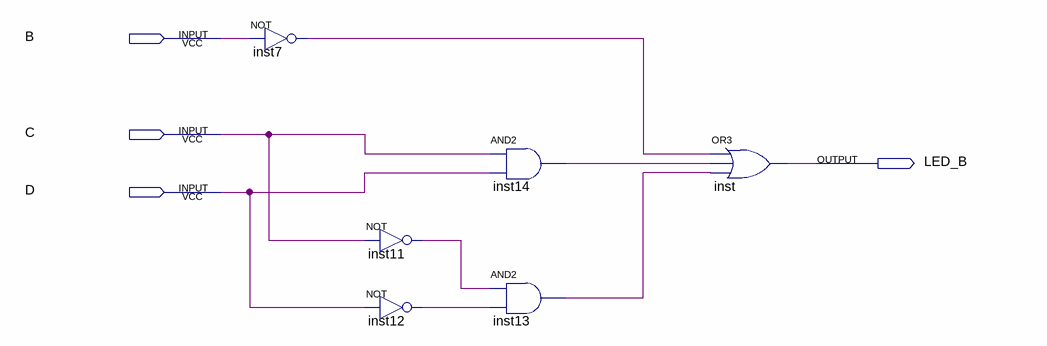
[diagram p0: schematic sheet]
// Quartus schematic led_b.bdf as structural Verilog: 6 symbols, 4 pins
module led_b (
  input  B,
  input  C,
  input  D,
  output LED_B
);

  wire inst7_out, inst11_out, inst12_out, inst13_out, inst14_out;

  not inst7 (inst7_out, B);
  not inst11 (inst11_out, C);
  not inst12 (inst12_out, D);
  and inst14 (inst14_out, C, D);
  and inst13 (inst13_out, inst11_out, inst12_out);
  or inst (LED_B, inst7_out, inst14_out, inst13_out);
endmodule
